# Altium schematic sheet USB1_13.SchDoc
size 420 x 297 mm; SheetNumber: 8; SheetTotal: 8
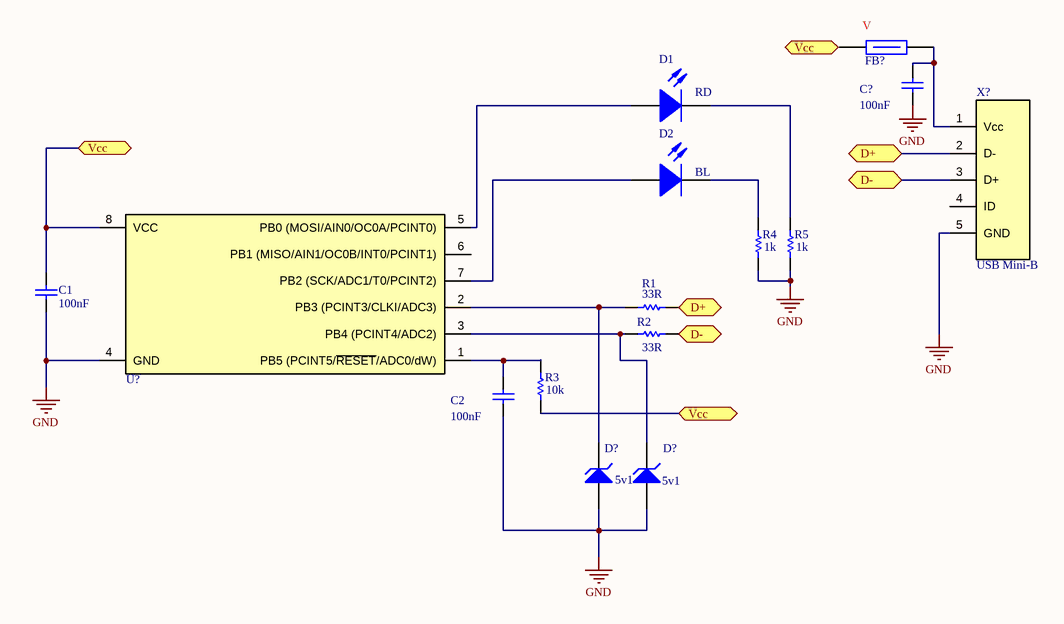
[diagram p0: USB1_13.SchDoc]

## Parts
(Parts that share a designator on the sheet are numbered #1, #2 ... from top to bottom, then left to right.)
C1  value 100nF  [Cap 0603]  (hidden comment: CMP-01150-5)
C2  value 100nF  [Cap 0603]  (hidden comment: CMP-01150-5)
C?  value 100nF  [Cap 0603]  (hidden comment: CMP-01150-5)
D1  value RD  [LED SMD0603]  (hidden comment: CMP-00471-6)
D2  value BL  [LED SMD0603]  (hidden comment: CMP-00698-3)
D?#1  BV: 5v1  (hidden comment: Zener Diode)
D?#2  BV: 5v1  (hidden comment: Zener Diode)
FB?  CMP-04392-1  [Fuses 0402]  (value not drawn)
R1  value 33R  [R0603 5%]  (hidden comment: CMP-03489-3)
R2  value 33R  [R0603 5%]  (hidden comment: CMP-03489-3)
R3  value 10k  [R0603 5%]  (hidden comment: CMP-03489-3)
R4  value 1k  [R0603 5%]  (hidden comment: CMP-03489-3)
R5  value 1k  [R0603 5%]  (hidden comment: CMP-03489-3)
U?  CMP-03380-4  [SOIC-8]  (value not drawn)
X?  value USB Mini-B  [Mini-USB, type B]  (hidden comment: CMP-00146-3)

## Ports
D+ (bidir), D- (bidir), Vcc (bidir)

## Nets
GND: C1.1 C2.1 C?.1 D?#1.1(A) D?#2.1(A) R4.1 R5.1 U?.4(GND) X?.5(GND)
D+: R1.2 X?.2(D-) ; port D+
D-: R2.2 X?.3(D+) ; port D-
Vcc: C1.2 R3.1 U?.8(VCC) ; port Vcc
NetC2_2: C2.2 R3.2 U?.1(PB5_(PCINT5/~{RESET}/ADC0/dW))
NetC?_2: C?.2 FB?.2 X?.1(Vcc)
NetD1_1: D1.1 U?.5(PB0_(MOSI/AIN0/OC0A/PCINT0))
NetD1_2: D1.2 R5.2
NetD2_1: D2.1 U?.7(PB2_(SCK/ADC1/T0/PCINT2))
NetD2_2: D2.2 R4.2
NetD?#1_2: D?#1.2(K) R1.1 U?.2(PB3_(PCINT3/CLKI/ADC3))
NetD?#2_2: D?#2.2(K) R2.1 U?.3(PB4_(PCINT4/ADC2))

Not connected (* = marked no-connect by the designer): FB? 1; U? 6(PB1_(MISO/AIN1/OC0B/INT0/PCINT1)); X? 4(ID)

## Notes on the sheet
- THIS DOCUMENT AND THE DATA DISCLOSED HEREIN OR
- HEREWITH IS THE PROPERTY OF ALTIUM LIMITED AND MAY
- DWG NO:
- REVISION
- REV:
- DESCRIPTION
- DATE
- APPROVED
- BE FREELY DISTRIBUTED IN WHOLE. NO RIGHTS ARE
- RESERVED OR EXPRESS OR IMPLIED WARANTEE GIVEN.
- ENG:
- APPROVALS
- PROJECT
- DSN:
- CHK:
- REFERENCE DOCUMENTS
- PROJECT REVISION:
- TITLE
- DOCUMENT REVISION:
- DESIGN ITEM:
- BOM:
- FAB DWG:
- PCB DWG:
- ASSY DWG:
- SCALE:
- A3
- SIZE
- CAGE CODE
- FILE NAME
- DWG NO.
- SHEET
- OF
- REV

## Library data of the parts
C1 C2 C? = CMP-001-00917-1: u10 x 50V; Component Name: Ceramic Capacitor, SMD, 0603, NP0, 43p x 50V; Marking: 43p; Case/Package: 0603; Pins: 2; Design Item ID: CMP-01150-5; Component Type: Standard; Source: Integrated_Library - 02.08.22 - 15.22.SchLib; Voltage: 50V
D1 = CMP-00026-00010-1: KT-SMD0603 red; Component Name: Mono-color Chip LED, KT-SMD0603, RED; Case/Package: 0603; Pins: 2; Design Item ID: CMP-00471-6; Component Type: Standard; Marking: RD; Mounting type: SMD; Source: Integrated_Library - 02.08.22 - 17.24 LED.SchLib; ComponentLink1Description: Datasheet; ComponentLink1URL: http://datasheet.octopart.com/5988010107F-Dialight-datasheet-148086.pdf
D2 = CMP-00026-00022-1: KT-SMD0603 blue; Component Name: Mono-color Chip LED, KT-SMD0603, BLUE; Case/Package: 0603; Pins: 2; Design Item ID: CMP-00698-3; Component Type: Standard; Marking: BL; Mounting type: SMD; Source: Integrated_Library - 02.08.22 - 17.24 LED.SchLib; ComponentLink1Description: Datasheet; ComponentLink1URL: http://datasheet.octopart.com/5988010107F-Dialight-datasheet-148086.pdf
D?#1 D?#2 = Zener Diode: AF: 1; BV_MAX: 1e99; CJO: 0; EG: 1.11; FC: 0.5; IBV: 0.001; IS: 1e-14; MJSW: 0.33; NTUN: 30; TNOM: 27; XTI: 3; SimulationGenericComponent: True; CJP: 0; CTA: 0; CTP: 0; FCS: 0.5; FV_MAX: 1e99; IKF: 0; IKR: 0; ISR: 1e-14; JSW: 0; JTUN: 0; JTUNSW: 0; KEG: 1; KF: 0; LEVEL: 1; N: 1; NBV: 1; NR: 1; NS: 1; PHP: 1; RS: 0; TCV: 0; TLEV: 0; TLEVC: 0; TM1: 0; TM2: 0; TPB: 0; TPHP: 0; TRS: 0; TRS2: 0; TT: 0; TTT1: 0; TTT2: 0; VJ: 1; XTITUN: 3
FB? = CMP-068-000000-1: 1.5 A AC 32 V DC Fuse Board Mount (Cartridge Style Excluded) Surface Mount 0402 (1005 Metric); Component Name: Fuse, ERB-RD1R50X, SMD, 0402, 1.5A; Value: 1.5A; Design Item ID: CMP-04392-1; Component Type: Standard; Package: 0402; Pin Count: 2; Source: Integrated_Library - 02.08.22 - 15.47.SchLib
R1-R5 = CMP-009-00319-1: 15K8; Component Name: Fixed resistor, SMD, 0603, 15K8 1%; Case/Package: 0603; Pins: 2; Design Item ID: CMP-03489-3; Component Type: Standard; Marking: 15K8; Source: Integrated_Library - 02.08.22 - 17.39 0603 1%.SchLib
U? = CMP-175-000005-1: ATTINY13-20SUR; Component Name: IC, Microcontroller, ATTINY13-20SUR, SOIC-8; Design Item ID: CMP-03380-4; Component Type: Standard; Marking: ATTINY13; Mounting type: SMD; Package: SOIC-8; Pin Count: 8; Source: Integrated_Library - 02.08.22 - 16.37.SchLib; Value: ATTINY13-20SUR; ComponentLink1Description: Datasheet; ComponentLink1URL: http://ww1.microchip.com/downloads/en/DeviceDoc/doc2535.pdf
X? = CMP-115-000001-1: USB Mini-B; Component Name: USB Mini-B, 5 pins, C1734035; Design Item ID: CMP-00146-3; Component Type: Standard; Datasheet: http://www.te.com/commerce/DocumentDelivery/DDEController?Action=showdoc&DocId=Customer+Drawing%7F1734035%7FA%7Fpdf%7FEnglish%7FENG_CD_1734035_A.pdf; Marking: USB Mini-B; Mounting type: SMT; Package: USB Mini-B; Pin Count: 5; Source: Integrated_Library - 02.08.22 - 16.06.SchLib